# EAGLE design MR BUS BOARD (EAGLE 9.6.2)
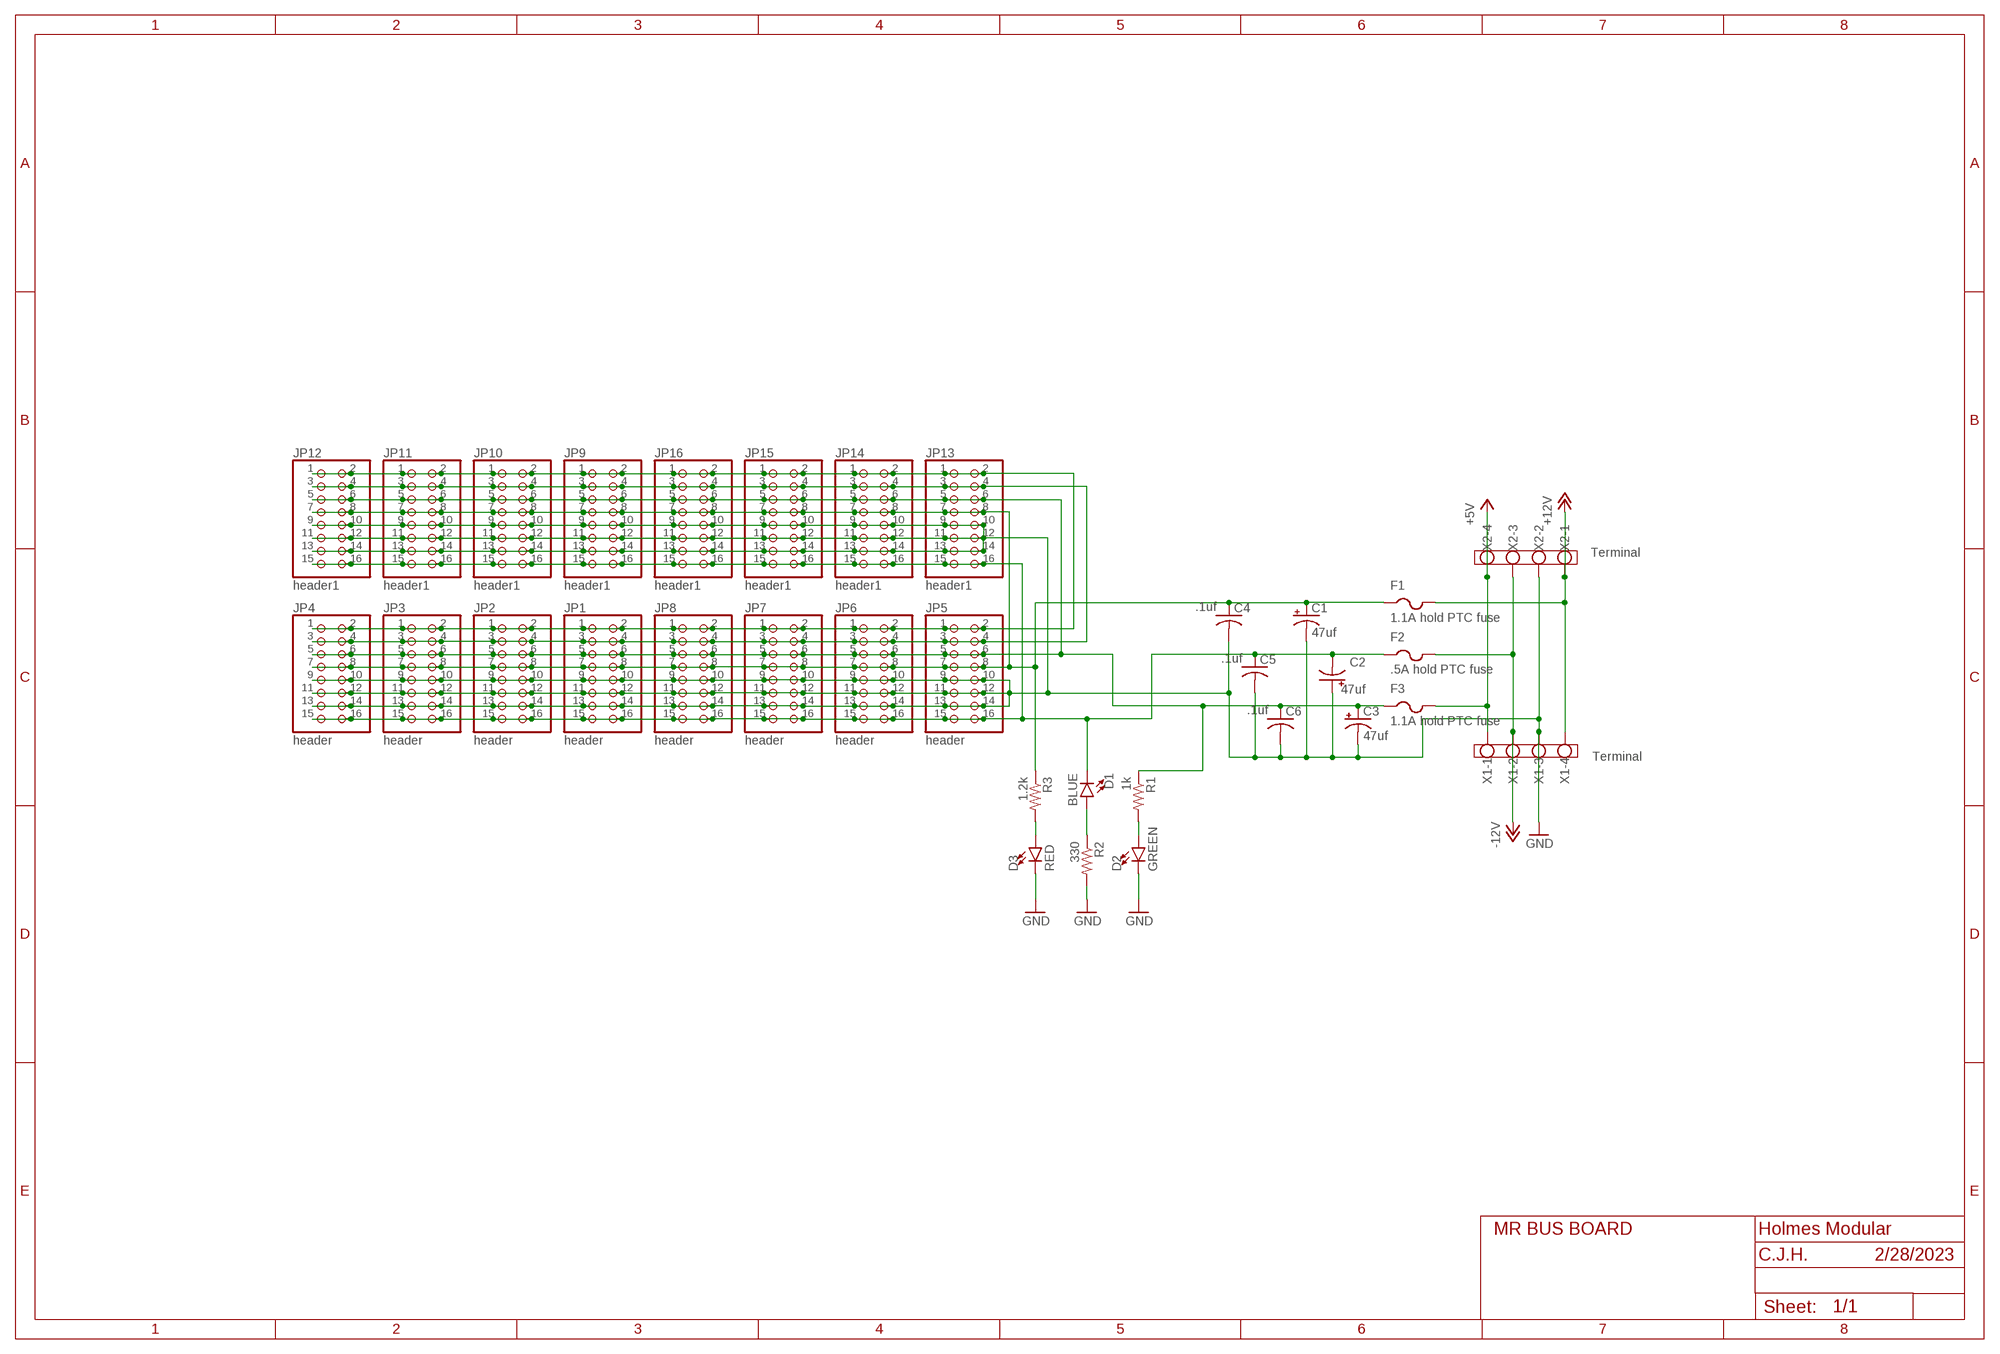
[diagram p0: schematic, sheet 1]

## Parts
C1  47uf  CPOL-USD  [PANASONIC_D]
C2  47uf  CPOL-USD  [PANASONIC_D]
C3  47uf  CPOL-USD  [PANASONIC_D]
C4  .1uf  C-USC0805K  [C0805K]
C5  .1uf  C-USC0805K  [C0805K]
C6  .1uf  C-USC0805K  [C0805K]
D1  BLUE  LED-BLUE0603  [LED-0603]
D2  GREEN  LED-GREEN0603  [LED-0603]
D3  RED  LED-RED0603  [LED-0603]
F1  1.1A hold PTC fuse  PTCFUSE-1812  [1812]
F2  .5A hold PTC fuse  PTCFUSE-1812  [1812]
F3  1.1A hold PTC fuse  PTCFUSE-1812  [1812]
JP1  header  PINHD-2X8SMT  [2X08_SMT]
JP2  header  PINHD-2X8SMT  [2X08_SMT]
JP3  header  PINHD-2X8SMT  [2X08_SMT]
JP4  header  PINHD-2X8SMT  [2X08_SMT]
JP5  header  PINHD-2X8SMT  [2X08_SMT]
JP6  header  PINHD-2X8SMT  [2X08_SMT]
JP7  header  PINHD-2X8SMT  [2X08_SMT]
JP8  header  PINHD-2X8SMT  [2X08_SMT]
JP9  header1  PINHD-2X8  [2X08]
JP10  header1  PINHD-2X8  [2X08]
JP11  header1  PINHD-2X8  [2X08]
JP12  header1  PINHD-2X8  [2X08]
JP13  header1  PINHD-2X8  [2X08]
JP14  header1  PINHD-2X8  [2X08]
JP15  header1  PINHD-2X8  [2X08]
JP16  header1  PINHD-2X8  [2X08]
R1  1k  R-US_R0805  [R0805]
R2  330  R-US_R0805  [R0805]
R3  1.2k  R-US_R0805  [R0805]
X1  Terminal  W237-4  [W237-4]
X2  Terminal  W237-4  [W237-4]

## Nets
+5V: F3.2 X1.1 X2.4
+12V: F1.2 X1.4 X2.1
-12V: F2.2 X1.2 X2.3
GND: C1.- C2.+ C3.- C4.2 C5.2 C6.2 D2.C D3.C JP1.9 JP1.10 JP1.11 JP1.12 JP1.13 JP1.14 JP2.9 JP2.10 JP2.11 JP2.12 JP2.13 JP2.14 JP3.9 JP3.10 JP3.11 JP3.12 JP3.13 JP3.14 JP4.9 JP4.10 JP4.11 JP4.12 JP4.13 JP4.14 JP5.9 JP5.10 JP5.11 JP5.12 JP5.13 JP5.14 JP6.9 JP6.10 JP6.11 JP6.12 JP6.13 JP6.14 JP7.9 JP7.10 JP7.11 JP7.12 JP7.13 JP7.14 JP8.9 JP8.10 JP8.11 JP8.12 JP8.13 JP8.14 JP9.9 JP9.10 JP9.11 JP9.12 JP9.13 JP9.14 JP10.9 JP10.10 JP10.11 JP10.12 JP10.13 JP10.14 JP11.9 JP11.10 JP11.11 JP11.12 JP11.13 JP11.14 JP12.9 JP12.10 JP12.11 JP12.12 JP12.13 JP12.14 JP13.9 JP13.10 JP13.11 JP13.12 JP13.13 JP13.14 JP14.9 JP14.10 JP14.11 JP14.12 JP14.13 JP14.14 JP15.9 JP15.10 JP15.11 JP15.12 JP15.13 JP15.14 JP16.9 JP16.10 JP16.11 JP16.12 JP16.13 JP16.14 R2.2 X1.3 X2.2
N$1: JP1.1 JP1.2 JP2.1 JP2.2 JP3.1 JP3.2 JP4.1 JP4.2 JP5.1 JP5.2 JP6.1 JP6.2 JP7.1 JP7.2 JP8.1 JP8.2 JP9.1 JP9.2 JP10.1 JP10.2 JP11.1 JP11.2 JP12.1 JP12.2 JP13.1 JP13.2 JP14.1 JP14.2 JP15.1 JP15.2 JP16.1 JP16.2
N$2: C2.- C5.1 D1.C F2.1 JP1.15 JP1.16 JP2.15 JP2.16 JP3.15 JP3.16 JP4.15 JP4.16 JP5.15 JP5.16 JP6.15 JP6.16 JP7.15 JP7.16 JP8.15 JP8.16 JP9.15 JP9.16 JP10.15 JP10.16 JP11.15 JP11.16 JP12.15 JP12.16 JP13.15 JP13.16 JP14.15 JP14.16 JP15.15 JP15.16 JP16.15 JP16.16
N$3: D3.A R3.2
N$5: D1.A R2.1
N$6: C1.+ C4.1 F1.1 JP1.7 JP1.8 JP2.7 JP2.8 JP3.7 JP3.8 JP4.7 JP4.8 JP5.7 JP5.8 JP6.7 JP6.8 JP7.7 JP7.8 JP8.7 JP8.8 JP9.7 JP9.8 JP10.7 JP10.8 JP11.7 JP11.8 JP12.7 JP12.8 JP13.7 JP13.8 JP14.7 JP14.8 JP15.7 JP15.8 JP16.7 JP16.8 R3.1
N$7: D2.A R1.2
N$8: JP1.3 JP1.4 JP2.3 JP2.4 JP3.3 JP3.4 JP4.3 JP4.4 JP5.3 JP5.4 JP6.3 JP6.4 JP7.3 JP7.4 JP8.3 JP8.4 JP9.3 JP9.4 JP10.3 JP10.4 JP11.3 JP11.4 JP12.3 JP12.4 JP13.3 JP13.4 JP14.3 JP14.4 JP15.3 JP15.4 JP16.3 JP16.4
N$14: C3.+ C6.1 F3.1 JP1.5 JP1.6 JP2.5 JP2.6 JP3.5 JP3.6 JP4.5 JP4.6 JP5.5 JP5.6 JP6.5 JP6.6 JP7.5 JP7.6 JP8.5 JP8.6 JP9.5 JP9.6 JP10.5 JP10.6 JP11.5 JP11.6 JP12.5 JP12.6 JP13.5 JP13.6 JP14.5 JP14.6 JP15.5 JP15.6 JP16.5 JP16.6 R1.1

## Notes on the sheet
- Holmes Modular
- C.J.H. | 2/28/2023

## Library data of the parts
C1-C3 = rcl:CPOL-US: POLARIZED CAPACITOR, American symbol; SPICEPREFIX: C
C4-C6 = rcl:C-US: CAPACITOR, American symbol; SPICEPREFIX: C
D1 = SparkFun-LED:LED-BLUE: Blue SMD LED Used in manufacturing of various products at SparkFun Packages: 0603 - SMD 0603 package [Product Link] <http://www.digikey.com/product-detail/en/SMLE12BC7TT86/511-1589-2-ND/1641808> 1206 - SMD1206 package [Product Link] <http://www.digikey.com/product-detail/en/lite-on-inc/LTST-C150TBKT/160-1643-1-ND/573584> SparkFun Products: ESP8266 Thing-Dev Board <https://www.sparkfun.com/products/13711> RedBoard <https://www.sparkfun.com/products/12757>; PROD_ID: DIO-08575
D2 = SparkFun-LED:LED-GREEN: Green SMD LED Used in manufacturing of various products at SparkFun Packages: 0603 - SMD 0603 package [Product Link] <http://www.futureelectronics.com/en/technologies/semiconductors/optoelectronics/leds/Pages/9894312-LTST-C190GKT.aspx?CrossPart=HSMG-C190&IM=0> LilyPad 1206 - SMD1206 LilyPad package [Product Link] <http://www.futureelectronics.com/en/Technologies/Product.aspx?ProductID=IN150NGHARVATEKCORPORATION2049943&IM=0> 1206 - SMD1206 package [Product Link] <http://www.futureelectronics.com/en/technologies/semiconductors/optoelectronics/leds/Pages/8315665-LTST-C150KGKT.aspx?IM=0> 1206 Bottom Mount -SMD 1206 Bottom Mount [Product Link] <http://www.digikey.com/product-detail/en/lite-on-inc/LTST-C230KGKT/160-1456-1-ND/386854> SparkFun Products: Pro Mini 328 -5V <https://www.sparkfun.com/products/821> RedBoard <https://www.sparkfun.com/products/12757> MP3 Trigger <https://www.sparkfun.com/products/13720> Makey Makey <https://www.sparkfun.com/products/11076>; PROD_ID: DIO-00821
D3 = SparkFun-LED:LED-RED: Red SMD LED Used in manufacturing of most products at SparkFun Packages: 0603 - SMD 0603 package [Product Link] <http://docs.avagotech.com/docs/AV02-0551EN> 0603 SMART - SMD 0603 SMART package ( more efficient and expensive)[Product Link] <http://www.osram-os.com/Graphics/XPic2/00077099_0.pdf> 1206 - SMD1206 package [Product Link] <https://www.sparkfun.com/datasheets/DevTools/LilyPad/Q150OVS4.pdff> SparkFun Products: Pro Mini 328 -5V <https://www.sparkfun.com/products/821> RedBoard <https://www.sparkfun.com/products/12757> IOIO-OTG <https://www.sparkfun.com/products/13613>; PROD_ID: DIO-00819
F1-F3 = adafruit:PTCFUSE: PTC fuses, resettable thermistors
JP1-JP16 = pinhead+:PINHD-2X8: PIN HEADER
R1-R3 = rcl:R-US_: RESISTOR, American symbol; SPICEPREFIX: R
X1 X2 = con-wago-500:W237-4: WAGO SCREW CLAMP; OC_FARNELL: unknown; OC_NEWARK: unknown

## Board
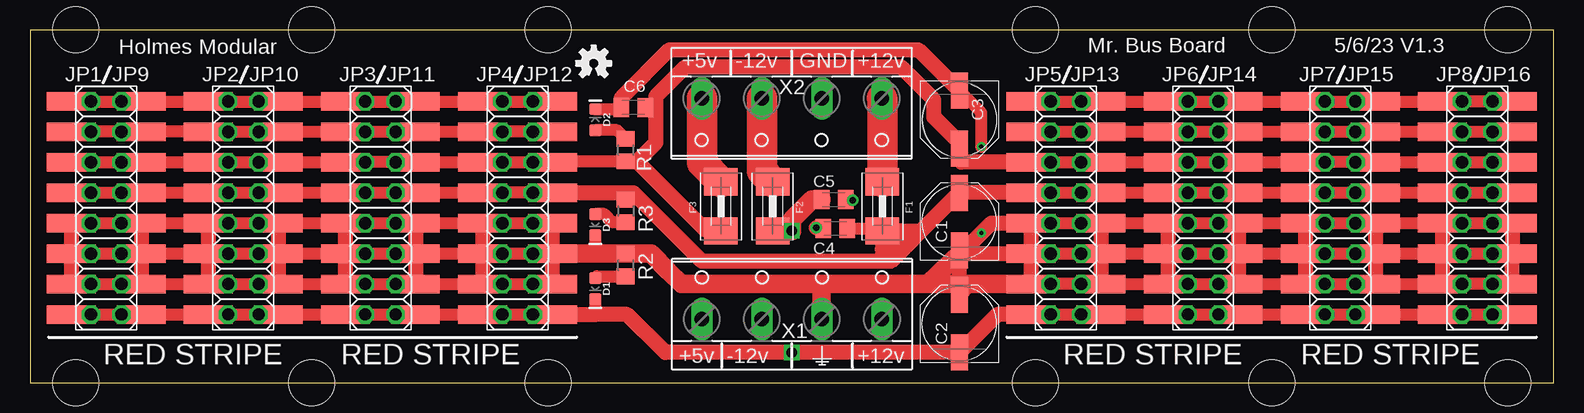
[diagram p1: board, top side]
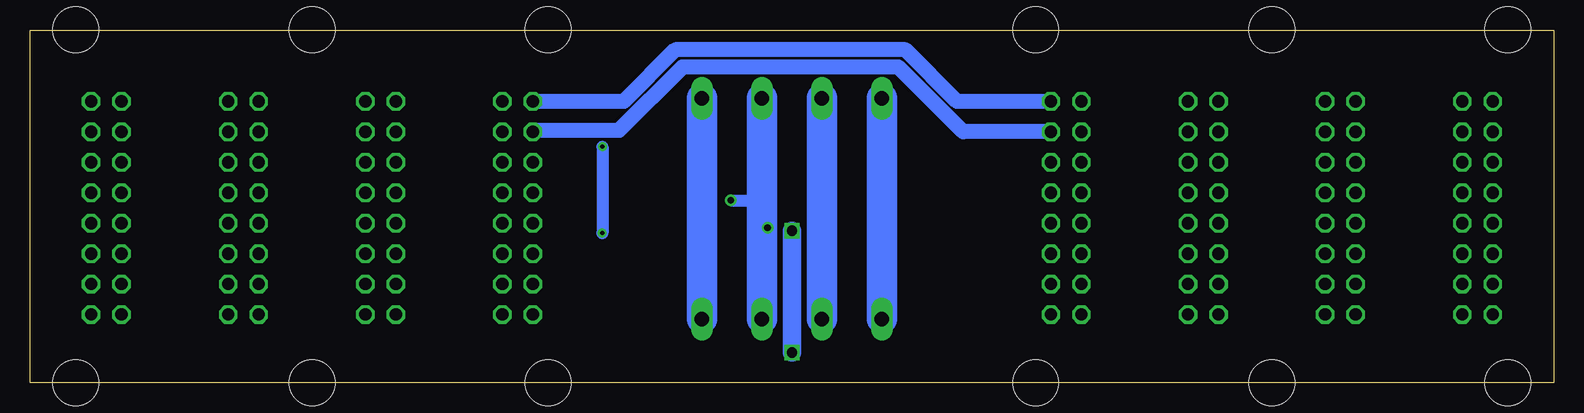
[diagram p2: board, bottom side, seen from below]

Size 127.01 x 29.45 mm. Coordinates in mm from the lower left corner, seen from the top.
Outline: 0,0 127.01,0 127.01,29.45 0,29.45 0,0
Copper layers (1*16): Top 0.035mm / dielectric 1.5mm / Bottom 0.035mm
Design rules "default": minimum track width 6mil, minimum drill 0.35mm, track to track 6mil, track to pad 6mil, pad to pad 6mil, via to via 6mil, smd to smd 6mil, copper to edge 40mil, drill to drill 6mil, minimum pad ring 10mil, minimum via ring 8mil, stop-mask expansion 4mil, vias tented up to drill 0mil, thermal gap 10mil
Holes 3.81 mm at 3.81,29.46 23.5,29.46 43.18,29.46 3.81,0 23.5,0 43.18,0 123.19,0 123.19,29.46 103.5,0 83.82,0 83.82,29.46 103.5,29.46

### Footprints (pad centres in the part's own frame; a part is rotated, then mirrored left to right if it is on the bottom)
PANASONIC_D = smd 3 x 1.4: + 2.4,0; - -2.4,0
C0805K = smd 1.3 x 1.6: 1 -1,0; 2 1,0
LED-0603 = smd 1 x 1: A -0.877,0; C 0.877,0
1812 = smd 2.286 x 2.794: 1 -2.046,0; 2 2.046,0
2X08_SMT = smd 1.524 x 4.064: 1 -8.89,-2.921; 2 -8.89,2.921; 3 -6.35,-2.921; 4 -6.35,2.921; 5 -3.81,-2.921; 6 -3.81,2.921; 7 -1.27,-2.921; 8 -1.27,2.921; 9 1.27,-2.921; 10 1.27,2.921; 11 3.81,-2.921; 12 3.81,2.921; 13 6.35,-2.921; 14 6.35,2.921; 15 8.89,-2.921; 16 8.89,2.921
2X08 = drill 1.016 octagon: 1 -8.89,-1.27; 2 -8.89,1.27; 3 -6.35,-1.27; 4 -6.35,1.27; 5 -3.81,-1.27; 6 -3.81,1.27; 7 -1.27,-1.27; 8 -1.27,1.27; 9 1.27,-1.27; 10 1.27,1.27; 11 3.81,-1.27; 12 3.81,1.27; 13 6.35,-1.27; 14 6.35,1.27; 15 8.89,-1.27; 16 8.89,1.27
R0805 = smd 1.3 x 1.5: 1 -0.95,0; 2 0.95,0
W237-4 = drill 1.194 long: 1 -7.5,-1.27; 2 -2.5,-1.27; 3 2.5,-1.27; 4 7.5,-1.27

### Placement (x,y rotation side)
C1  77.47,13.46 90 top
C2  77.47,4.95 90 top
C3  77.47,21.97 270 top
C4  67.12,12.89 180 top
C5  66.99,15.3 0 top
C6  50.29,22.99 180 top
D1  47.12,7.87 270 top
D2  47.12,21.97 90 top
D3  47.12,13.21 270 top
F1  71.06,14.73 90 top
F2  61.91,14.73 90 top
F3  57.59,14.73 90 top
JP1  6.35,14.61 270 top
JP2  17.78,14.61 270 top
JP3  29.21,14.61 270 top
JP4  40.64,14.61 270 top
JP5  86.36,14.61 270 top
JP6  97.79,14.61 270 top
JP7  109.22,14.61 270 top
JP8  120.65,14.61 270 top
JP9  6.35,14.61 270 top
JP10  17.78,14.61 270 top
JP11  29.21,14.61 270 top
JP12  40.64,14.61 270 top
JP13  86.36,14.61 270 top
JP14  97.79,14.61 270 top
JP15  109.22,14.61 270 top
JP16  120.65,14.61 270 top
R1  49.66,19.43 90 top
R2  49.66,9.84 90 top
R3  49.66,14.35 270 top
U$2  [OSHW-LOGO-S]  46.99,26.67 0 top
X1  63.5,6.6 0 top
X2  63.5,22.48 180 top

### Tracks (layer width: path | path; a pad name or v marks a point on that pad's centre or on a via)
+5V
  Top 2.54: X2.4 56,18.37 F3.2
  Bottom 2.54: X2.4 X1.1
+12V
  Top 2.54: F1.2 71.06,23.69 X2.1
  Bottom 2.54: X2.1 X1.4
-12V
  Top 2.54: F2.2 61,17.69 X2.3
  Bottom 2.54: X2.3 X1.2
GND  (via drill 0.35, 0.55)
  Top 1.016: D3.C 47.12,10.79 | D2.C 49.15,22.85 C6.2 49.29,23.79 | v79.31,12.51 77.74,10.94 77.74,10.79 | v79.3,19.72 79.3,22.54 C3.- | JP1.13 JP9.13 JP9.14 JP1.14 JP2.13 JP10.13 JP10.14 JP2.14 JP3.13 JP11.13 JP11.14 JP3.14 JP4.13 JP12.13 JP12.14 JP4.14 | JP1.11 JP9.11 JP9.12 JP1.12 JP2.11 JP10.11 JP10.12 JP2.12 JP3.11 JP11.11 JP11.12 JP3.12 JP4.11 JP12.11 JP12.12 JP4.12 | JP1.9 JP9.9 JP9.10 JP1.10 JP2.9 JP10.9 JP10.10 JP2.10 JP3.9 JP11.9 JP11.10 JP3.10 JP4.9 JP12.9 JP12.10 JP4.10 | JP8.12 JP16.12 JP16.11 JP8.11 JP7.12 JP15.12 JP15.11 JP7.11 JP6.12 JP14.12 JP14.11 JP6.11 JP5.12 JP13.12 JP13.11 JP5.11 | JP8.14 JP16.14 JP16.13 JP8.13 JP7.14 JP15.14 JP15.13 JP7.13 JP6.14 JP14.14 JP14.13 JP6.13 JP5.14 JP13.14 JP13.13 JP5.13 | JP8.10 JP16.10 JP16.9 JP8.9 JP7.10 JP15.10 JP15.9 JP7.9 JP6.10 JP14.10 JP14.9 JP6.9 JP5.10 JP13.10 JP13.9 JP5.9 | C5.2 68.52,15.3 v68.58,15.24
  Top 1.27: 77.74,10.79 77.47,10.53 C2.+ 78.37,8.26 JP5.13 JP5.11 | JP4.12 | JP4.14 JP4.12 | JP4.12 JP4.10 | JP5.11 JP5.9 80.14,13.34 77.86,11.06 C1.- 77.61,10.93 77.74,10.79 | JP8.10 JP8.12 JP8.14 | JP1.9 JP1.11 JP1.13 | 49.29,23.79 53.29,27.79 74.05,27.79 C3.- | JP1.10 JP1.14 | JP2.9 JP2.13 | JP2.10 JP2.14 | JP3.9 JP3.13 | JP3.10 JP3.14 | JP4.9 JP4.13 | JP5.10 JP5.14 | JP6.9 JP6.13 | JP6.10 JP6.14 | JP7.9 JP7.13 | JP7.10 JP7.14 | JP8.9 JP8.13 | 77.74,10.79 JP5.11 | v65.53,12.95 66.06,12.95 C4.2
  Top 1.524: JP4.12 47.12,10.79 R2.2 51.75,10.79 53.24,9.3 54.29,8.26 65.98,8.26 | 65.98,8.26 74.8,8.26 | 77.61,10.93 74.8,8.26 | X1.3 65.99,5.34 65.98,8.26 | 74.8,8.26 JP5.13
  Bottom 1.016: v79.3,19.72 79.3,12.52 v79.31,12.51 | v68.58,15.24 66,15.24
  Bottom 1.27: v65.53,12.95 66,12.23 X1.3
  Bottom 2.54: X1.3 66,15.24 X2.2
N$1
  Top 1.016: JP1.1 JP9.1 JP9.2 JP1.2 JP2.1 JP10.1 JP10.2 JP2.2 JP3.1 JP11.1 JP11.2 JP3.2 JP4.1 JP12.1 JP12.2 JP4.2 | JP5.1 JP13.1 JP13.2 JP5.2 JP6.1 JP14.1 JP14.2 JP6.2 JP7.1 JP15.1 JP15.2 JP7.2 JP8.1 JP16.1 JP16.2 JP8.2
  Bottom 1.27: JP12.2 49.73,23.5 54.02,27.79 73.23,27.79 77.53,23.5 JP13.1
N$2  (via drill 0.85)
  Top 1.016: D1.C 47.12,5.72 | JP1.15 JP9.15 JP9.16 JP1.16 JP2.15 JP10.15 JP10.16 JP2.16 JP3.15 JP11.15 JP11.16 JP3.16 JP4.15 JP12.15 JP12.16 JP4.16 | JP8.16 JP16.16 JP16.15 JP8.15 JP7.16 JP15.16 JP15.15 JP7.15 JP6.16 JP14.16 JP14.15 JP6.15 JP5.16 JP13.16 JP13.15 JP5.15
  Top 1.27: JP5.15 80.63,5.71 C2.- 63.51,2.55 v63.5,2.54 52.96,2.54 49.78,5.72 47.12,5.72 JP4.16
  Top 1.524: F2.1 63.49,12.69 v63.5,12.7 63.5,13.62 65.18,15.3 C5.1
  Bottom 1.524: v63.5,12.7 v63.5,2.54
N$3
  Top 1.016: R3.2 48.58,13.4 47.89,14.09 D3.A
N$5
  Top 1.016: D1.A 47.26,8.89 R2.1
N$6
  Top 1.016: JP1.7 JP9.7 JP9.8 JP1.8 JP2.7 JP10.7 JP10.8 JP2.8 JP3.7 JP11.7 JP11.8 JP3.8 JP4.7 JP12.7 JP12.8 JP4.8 | JP8.8 JP16.8 JP16.7 JP8.7 JP7.8 JP15.8 JP15.7 JP7.7 JP6.8 JP14.8 JP14.7 JP6.7 JP5.8 JP13.8 JP13.7 JP5.7 | C4.1 70.85,12.89 F1.1
  Top 1.27: JP5.7 77.48,15.88 C1.+ 77.46,15.86 74.23,12.64 | JP4.8 50.04,15.88 | 50.04,15.88 50.29,15.88 56.01,10.16 70.1,10.16 71.12,10.16 | R3.1 49.66,15.49 50.04,15.88 | 74.23,12.64 72.96,11.37 | 72.96,11.37 71.75,10.16 71.12,10.16 | F1.1 71.06,11.18 | 71.06,11.18 71.06,10.22 71.12,10.16 | F1.1 72.38,11.37 | 72.38,11.37 72.96,11.37 | 72.38,11.37 71.25,11.37 71.06,11.18 | F1.1 72.64,12.69 | 72.64,12.69 74.18,12.69 74.23,12.64 | 72.38,11.37 72.64,11.63 72.64,12.69
N$7
  Top 1.016: R1.2 48.94,21.09 D2.A
N$8
  Top 1.016: JP10.4 JP10.3 JP2.3 JP1.4 JP9.4 JP9.3 JP1.3 | JP2.4 JP3.3 JP11.3 JP11.4 JP3.4 JP4.3 JP12.3 JP4.4 JP12.4 | JP5.3 JP13.3 JP13.4 JP5.4 JP6.3 JP14.3 JP14.4 JP6.4 JP7.3 JP15.3 JP15.4 JP7.4 JP8.3 JP16.3 JP16.4 JP8.4
  Top 1.27: JP2.4 JP10.4
  Bottom 1.27: JP12.4 49.22,20.95 54.63,26.36 72.62,26.36 77.91,21.08 84.96,21.08 JP13.3
N$14
  Top 1.016: 77.61,18.41 77.47,18.55 C3.+ | C6.1 52.16,22.99 | R1.1 43.63,18.48 | JP1.5 JP9.5 JP9.6 JP1.6 JP2.5 JP10.5 JP10.6 JP2.6 JP3.5 JP11.5 JP11.6 JP3.6 JP4.5 JP12.5 JP12.6 JP4.6 | JP8.6 JP16.6 JP16.5 JP8.5 JP7.6 JP15.6 JP15.5 JP7.5 JP6.6 JP14.6 JP14.5 JP6.5 JP5.6 JP13.6 JP13.5 JP5.5
  Top 1.27: JP5.5 77.61,18.41 | 43.63,18.48 JP4.6 | C3.+ 77.47,20.04 75.35,22.16 75.35,23.64 72.63,26.35 54.62,26.35 52.16,23.9 52.16,22.99 52.16,20.03 50.61,18.48 R1.1 50.61,18.48 56.4,12.69 F3.1

### Text on the board
tNames: Mr. Bus Board | 5/6/23 V1.3 | Holmes Modular | +5v | -12v | GND | +12v | RED STRIPE | RED STRIPE | +5v | -12v | +12v | RED STRIPE | RED STRIPE